# Altium schematic sheet Top.SchDoc: GSR EMG Breakout Board
size B; DrawnBy: Jun Zhang; Revision: A; SheetNumber: 1; SheetTotal: 4
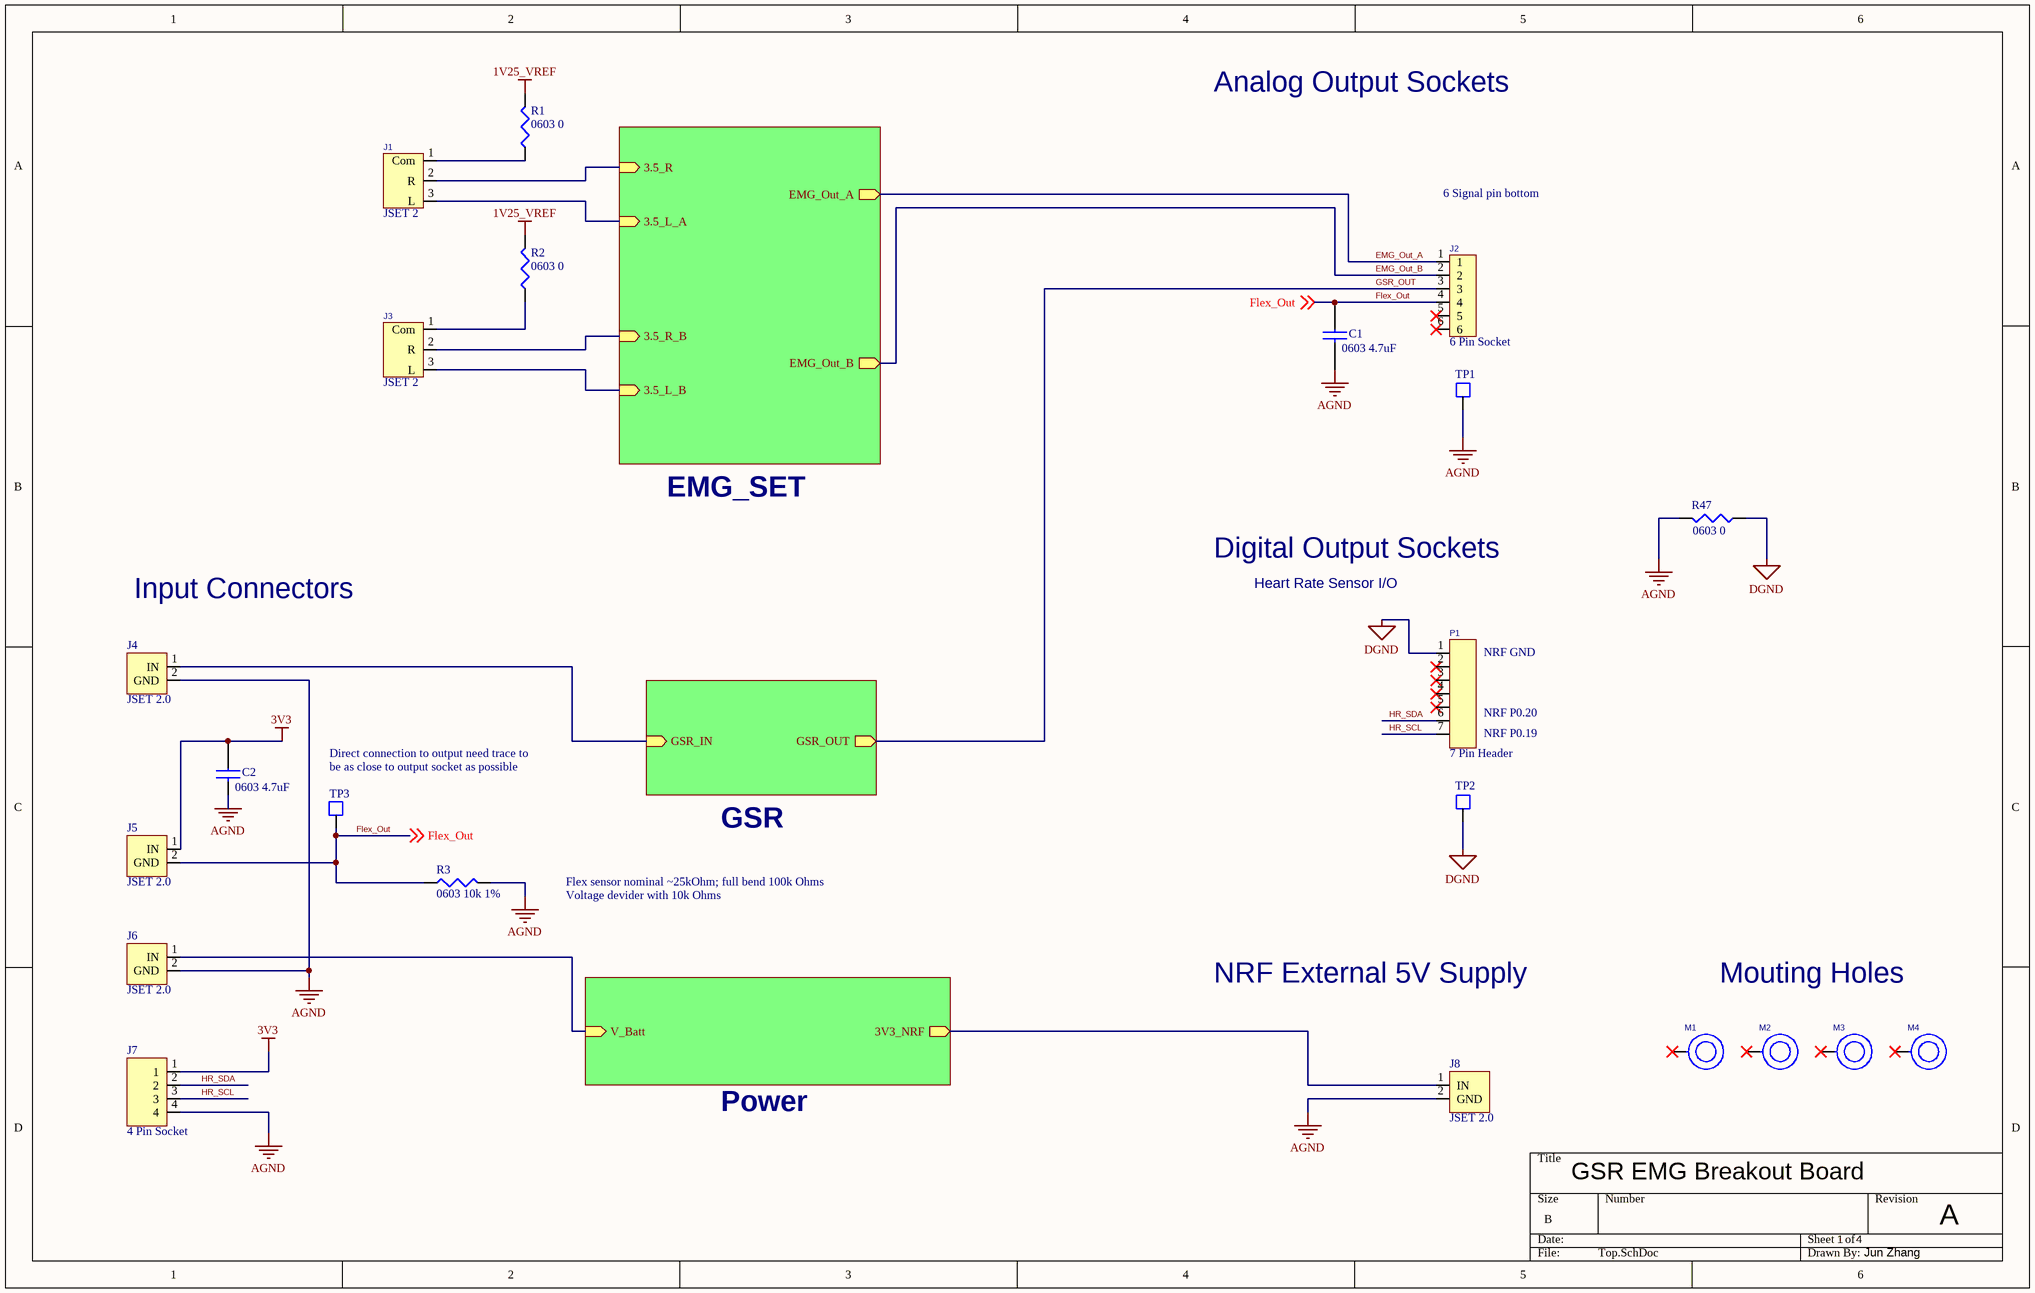
[diagram p0: Top.SchDoc]

## Parts
C1  0603 4.7uF  [CAP_0603_CER]
C2  0603 4.7uF  [CAP_0603_CER]
J1  JSET 2  [JST-XH3A]
J2  6 Pin Socket  [6 Pin Header]
J3  JSET 2  [JST-XH3A]
J4  JSET 2.0  [JST_XH2A]
J5  JSET 2.0  [JST_XH2A]
J6  JSET 2.0  [JST_XH2A]
J7  4 Pin Socket  [JST-XH4A]
J8  JSET 2.0  [JST_XH2A]
M1  Mounting Hole  [Mounting Hole]  (value not drawn)
M2  Mounting Hole  [Mounting Hole]  (value not drawn)
M3  Mounting Hole  [Mounting Hole]  (value not drawn)
M4  Mounting Hole  [Mounting Hole]  (value not drawn)
P1  7 Pin Header  [7 Pin Header]
R1  0603 0  [0603]
R2  0603 0  [0603]
R3  0603 10k 1%  [0603]
R47  0603 0  [0603]
TP1  0402_TEST_PT  [0402_PAD]  (value not drawn)
TP2  0402_TEST_PT  [0402_PAD]  (value not drawn)
TP3  0402_TEST_PT  [0402_PAD]  (value not drawn)

## Sub-sheets
EMG_SET = EMG.SchDoc: 3.5_R (in), EMG_Out_A (out), 3.5_L_A (in), 3.5_R_B (in), EMG_Out_B (out), 3.5_L_B (in)
GSR = GSR.SchDoc: GSR_OUT (out), GSR_IN (in)
Power = Power.SchDoc: V_Batt (in), 3V3_NRF (out)

## Nets
1V25_VREF: R1.1 R2.1
3V3: C2.1 J5.1(IN) J7.1
AGND: C1.2 C2.2 J4.2(GND) J6.2(GND) J7.4 J8.2(GND) R3.2 R47.1 TP1.1
DGND: P1.1 R47.2 TP2.1
EMG_Out_A: J2.1 ; sheet EMG_SET/EMG_Out_A
EMG_Out_B: J2.2 ; sheet EMG_SET/EMG_Out_B
Flex_Out: C1.1 J2.4 J5.2(GND) R3.1 TP3.1 ; off-sheet Flex_Out
GSR_OUT: J2.3 ; sheet GSR/GSR_OUT
HR_SCL: J7.3 P1.7
HR_SDA: J7.2 P1.6
NetJ1_1: J1.1(Com) R1.2
NetJ1_2: J1.2(R) ; sheet EMG_SET/3.5_R
NetJ1_3: J1.3(L) ; sheet EMG_SET/3.5_L_A
NetJ3_1: J3.1(Com) R2.2
NetJ3_2: J3.2(R) ; sheet EMG_SET/3.5_R_B
NetJ3_3: J3.3(L) ; sheet EMG_SET/3.5_L_B
NetJ4_1: J4.1(IN) ; sheet GSR/GSR_IN
NetJ6_1: J6.1(IN) ; sheet Power/V_Batt
NetJ8_1: J8.1(IN) ; sheet Power/3V3_NRF

Not connected (* = marked no-connect by the designer): J2 5* 6*; M1 1*; M2 1*; M3 1*; M4 1*; P1 2* 3* 4* 5*

## Notes on the sheet
- Analog Output Sockets
- 6 Signal pin bottom
- Digital Output Sockets
- Input Connectors
- Heart Rate Sensor I/O
- (near P1) NRF GND
- Direct connection to output need trace to
- (near TP3) be as close to output socket as possible
- (near P1) NRF P0.20
- (near P1) NRF P0.19
- Flex sensor nominal ~25kOhm; full bend 100k Ohms
- Voltage devider with 10k Ohms
- NRF External 5V Supply
- Mouting Holes

## Library data of the parts
C1 C2 = CAP_NP: Generic Cap for NC (No Polar) / ESR <30mOhm / ESL <1.5nH, / X5R; Manufacturer: Samsung Electro-Mechanics; Manufacturer Part Number: CL10A475KO8NNNC; ComponentLink1Description: New link; ComponentLink1URL: *; Capacitance: 4.7uF; Package: 0603; Dielectric: X5R; Supplier 1: Digi-Key; Supplier Part Number 1: 1276-1784-1-ND
J1 J3 = JST 3 Pin: JST-XH3A
J2 = 6 Pin Socket: Headers for Signal to NRF
J4-J6 J8 = JST 2 Pin: PA Series 2 Position 2 mm Pitch Top Entry No Boss Through Hole Shrouded Header; Manufacturer: JST; Manufacturer Part Number: B02B-PASK(LF)(SN); Number of Positions: 2; Connector Type: Male Pin; Pitch: 0.079inch; RoHS: Yes; Category: Headers and Wire Housings; Stock 1: 64007; Pricing 1: 1=0.25000, 10=0.20800, 100=0.15980, 500=0.13522, 1000=0.11064, 5000=0.09835, 10000=0.08913 (USD); Mount: Through Hole; Color: Natural; Contact Plating: Tin; Contact Material: Copper Alloy; Housing Color: White; Number of Rows: 1; Fastening Type: Ramp; Packaging: Bulk; Termination: Kinked Pin; Number of Contacts: 2; Series: PA; Contact Type: Male Pin; Contact Mating Length: 0.126inch; Lead Free: Lead Free; ComponentLink1URL: https://datasheet.ciiva.com/712/epa-f-712485.pdf?src-supplier=Digi-Key; ComponentLink1Description: https://datasheet.ciiva.com/712/epa-f-712485.pdf?src-supplier=Digi-Key
J7 = JST 4 Pin: Connector Header, PA Series, Top Entry , 4 Position, Male Pin, 1 Row, 2.0mm, Through Hole, Natural; Manufacturer: JST; Manufacturer Part Number: B04B-PASK(LF)(SN); Number of Positions: 4; Pitch: 0.079inch; Supplier 1: Digi-Key; Supplier Part Number 1: 455-1819-ND; RoHS: Yes; Category: Connectors; Stock 1: 11525; Pricing 1: 1=0.34000, 10=0.28700, 100=0.22360, 500=0.19162, 1000=0.15968, 5000=0.13687, 10000=0.12774 (USD); Mount: Through Hole; Color: Natural; Contact Plating: Tin; Contact Material: Copper Alloy; Housing Color: White; Number of Rows: 1; Fastening Type: Ramp; Packaging: Bulk; Termination: Kinked Pin; Connector Type: Male Pin; Series: PA; Contact Type: Male Pin; Number of Contacts: 4; Contact Mating Length: 0.126inch; Lead Free: Lead Free; ComponentLink1URL: https://datasheet.ciiva.com/712/epa-f-712564.pdf?src-supplier=Digi-Key; ComponentLink1Description: https://datasheet.ciiva.com/712/epa-f-712564.pdf?src-supplier=Digi-Key
P1 = 7 Pin Socket: KK 254 Wire-to-Board Header Single Row Vertical 7 Circuits PA Polyamide Nylon Tin (Sn) Plating; Manufacturer: Molex; Contact Resistance: 10mR; Max Current Rating: 4A; Voltage Rating: 250V; Number of Positions: 7; Gender: Male; Insulation Resistance: 50GR; Pitch: 2.54mm; Glow Wire Compliant: Non-compliant; Supplier 1: Digi-Key; Supplier Part Number 1: WM4005-ND; Manufacturer Part Number: 22-03-2071; RoHS: Yes; Category: Headers and Wire Housings; Stock 1: 11624; Pricing 1: 1=0.82000, 10=0.69600, 100=0.54110, 1000=0.42516, 5000=0.37362, 10000=0.34785 (USD); Mount: Through Hole; Contact Plating: Tin,Copper; Contact Material: Brass; Weight: 0.016932oz; Housing Color: White; Color: White; Housing Material: Nylon; Min Operating Temperature: 0°C; Max Operating Temperature: 75°C; Number of Rows: 1; Packaging: Bulk; Current Rating: 4A; Contact Gender: Male; Termination: Solder; Number of Contacts: 7; Max Voltage Rating (AC): 250V; Orientation: Straight; Voltage Rating (DC): 250V; Number of Circuits: 7; Series: KK® 4030; Contact Type: Male Pin; Length: 17.53mm; Height: 6.3mm; Contact Mating Length: 0.295inch; Depth: 2.34mm; Radiation Hardening: No; RoHS Compliant: Yes; REACH SVHC: Unknown; Halogen Free: Low Halogen; Lead Free: Lead Free; Flammability Rating: UL94 V-0; ComponentLink1URL: https://datasheet.ciiva.com/5147/0022032071-pcb-headers-158424-5147929.pdf?src-supplier=Mouser; ComponentLink1Description: https://datasheet.ciiva.com/5147/0022032071-pcb-headers-158424-5147929.pdf?src-supplier=Mouser; ComponentLink2URL: https://datasheet.ciiva.com/11747/0900766b80027332-11747589.pdf?src-supplier=RSComponents; ComponentLink2Description: https://datasheet.ciiva.com/11747/0900766b80027332-11747589.pdf?src-supplier=RSComponents; ComponentLink3URL: https://datasheet.ciiva.com/16656/0022032071-pcb-headers-16656194.pdf?src-supplier=Avnet+Europe; ComponentLink3Description: https://datasheet.ciiva.com/16656/0022032071-pcb-headers-16656194.pdf?src-supplier=Avnet+Europe; ComponentLink4URL: https://datasheet.ciiva.com/19461/878614-19461332.pdf?src-supplier=Jameco; ComponentLink4Description: https://datasheet.ciiva.com/19461/878614-19461332.pdf?src-supplier=Jameco; ComponentLink5URL: https://datasheet.ciiva.com/10087/0022032071-pcb-headers-10087718.pdf?src-supplier=Avnet; ComponentLink5Description: https://datasheet.ciiva.com/10087/0022032071-pcb-headers-10087718.pdf?src-supplier=Avnet; ComponentLink6URL: https://datasheet.ciiva.com/1433/1533907-1433547.pdf?src-supplier=Element14; ComponentLink6Description: https://datasheet.ciiva.com/1433/1533907-1433547.pdf?src-supplier=Element14; ComponentLink7URL: https://datasheet.ciiva.com/1433/1831754-1433548.pdf?src-supplier=Element14; ComponentLink7Description: https://datasheet.ciiva.com/1433/1831754-1433548.pdf?src-supplier=Element14; ComponentLink8URL: https://datasheet.ciiva.com/15217/getdatasheetpartid-176575-15217532.pdf?src-supplier=Verical; ComponentLink8Description: https://datasheet.ciiva.com/15217/getdatasheetpartid-176575-15217532.pdf?src-supplier=Verical
R1 R2 R47 = RESISTOR: Generic Resistor; Manufacturer: YAGEO; Resistance: 0; Manufacturer Part Number: *; Package: 0603
R3 = RESISTOR: Generic Resistor; Manufacturer: YAGEO; Manufacturer Part Number: *; Resistance: 10k; Package: 0603